# Altium project TX.PrjPCB
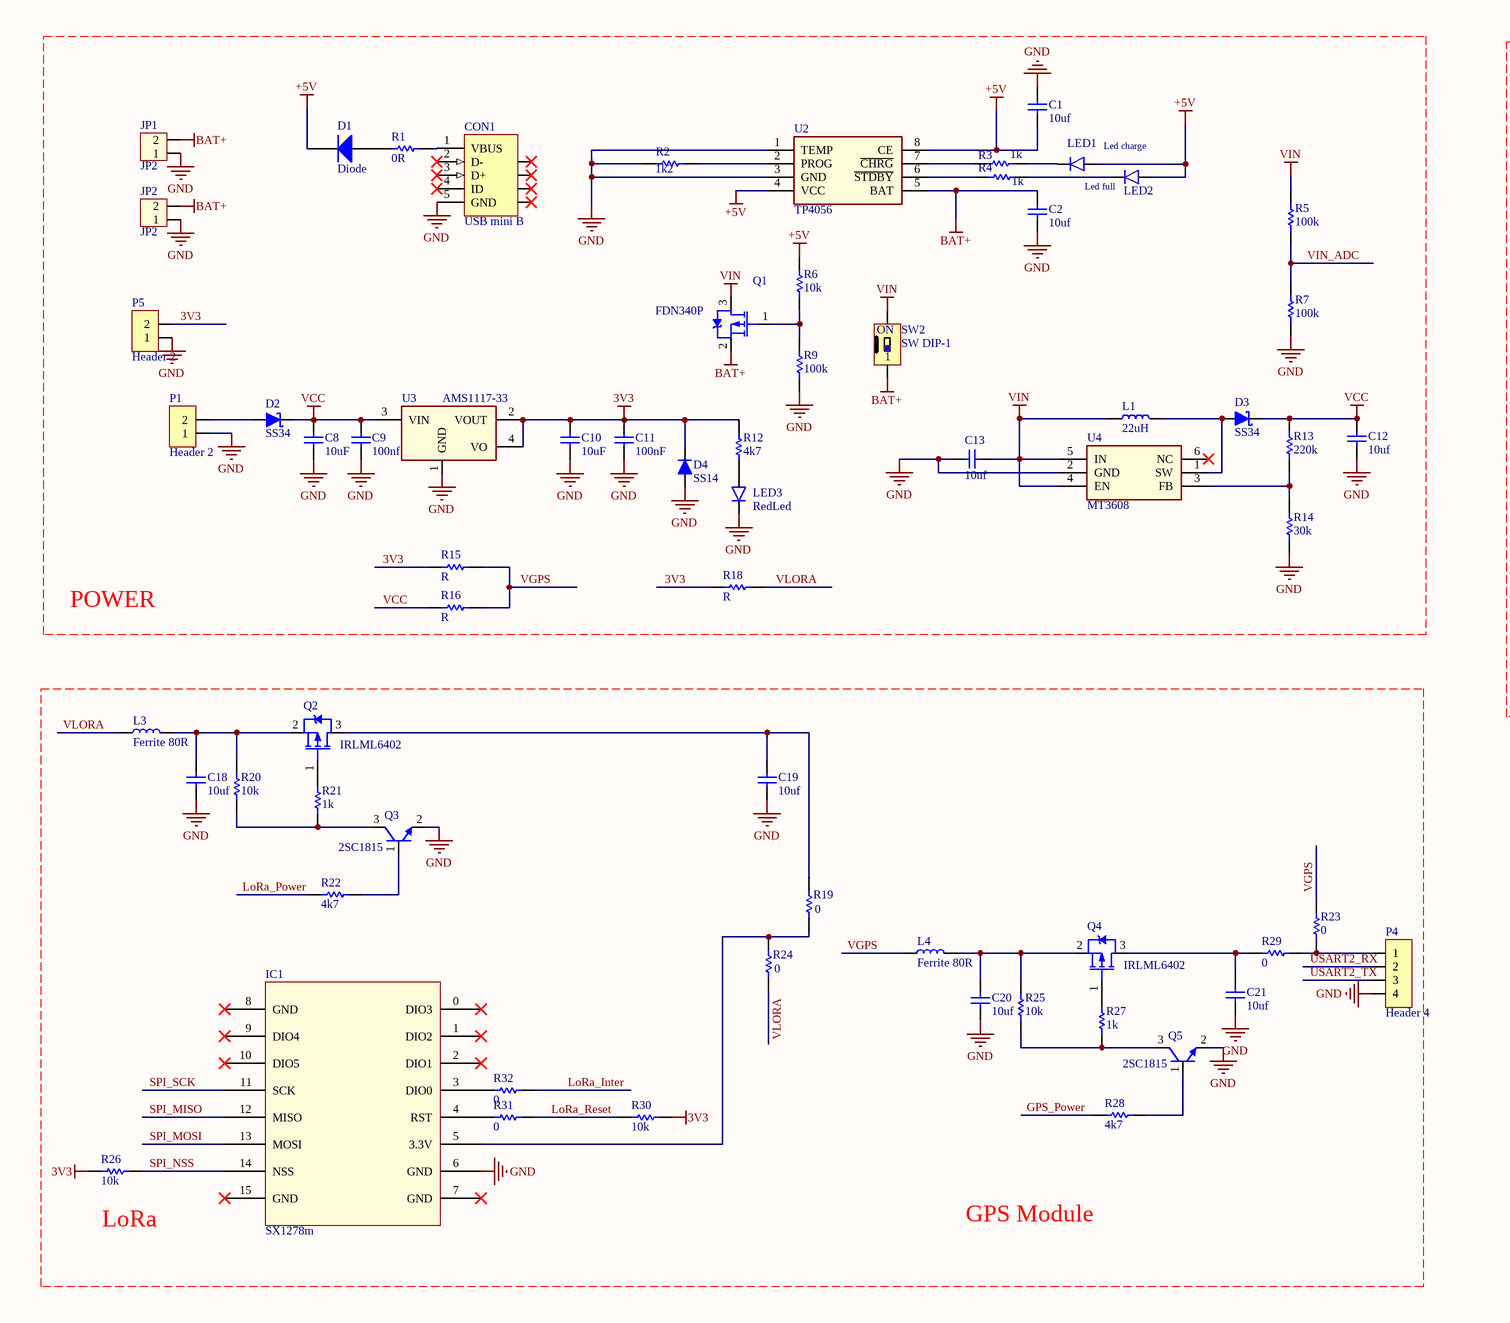
[diagram p0: Schematic_TX.schdoc, left]
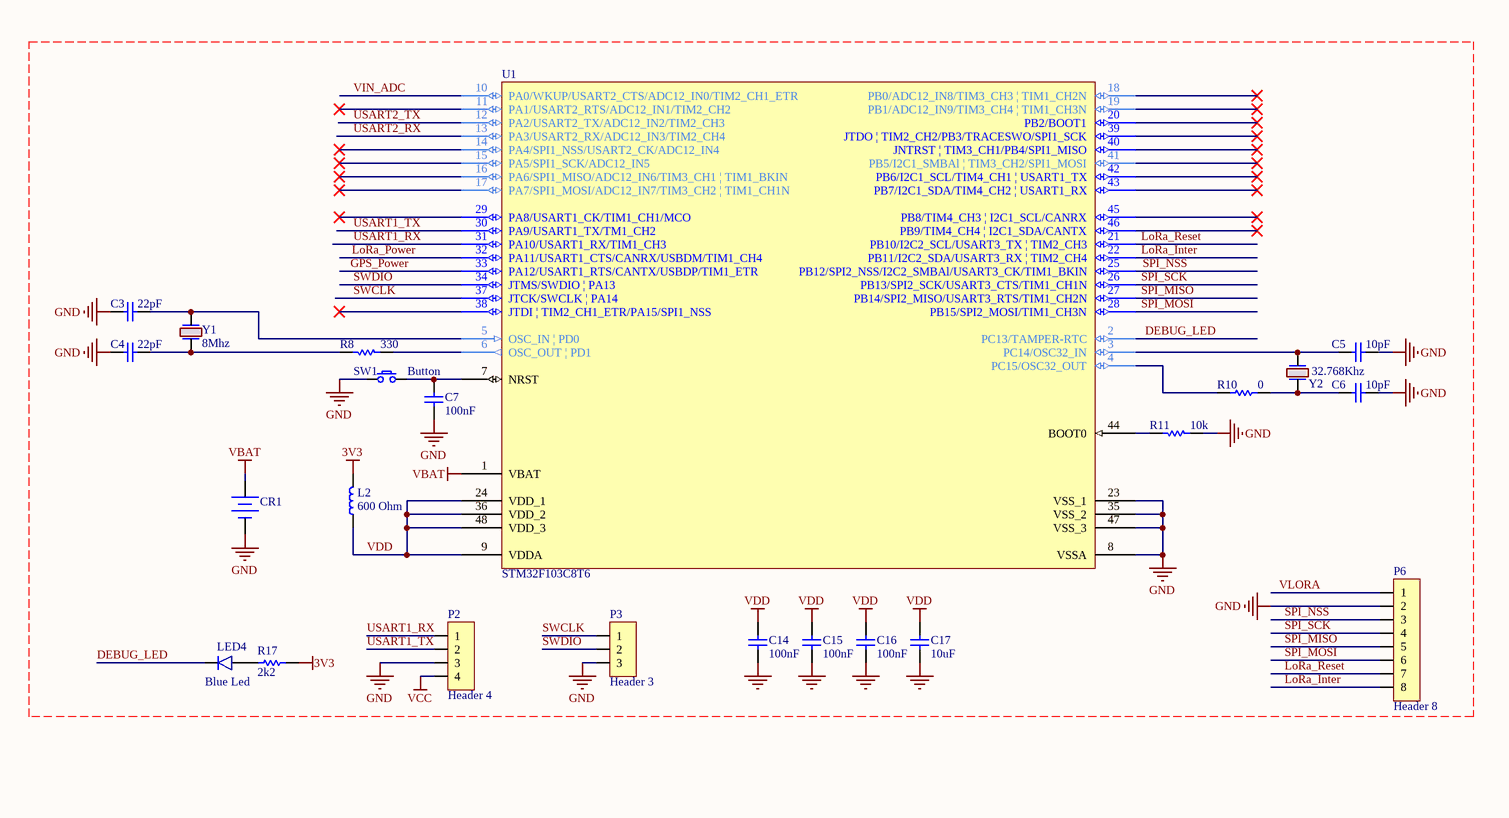
[diagram p1: Schematic_TX.schdoc, right]
1 sheet, 89 parts. Net scope: global (net labels, ports and power ports of the same name join across sheets).
Board file: PCB_TX.PcbDoc

## Sheet Schematic_TX.schdoc
size A1

### Parts
C1  10uf  [C 0805 (2012)]
C2  10uf  [C 0805 (2012)]
C3  22pF  [C 0805 (2012)]
C4  22pF  [C 0805 (2012)]
C5  10pF  [C 0805 (2012)]
C6  10pF  [C 0805 (2012)]
C7  100nF  [C 0805 (2012)]
C8  10uF  [C 0805 (2012)]
C9  100nf  [C 0805 (2012)]
C10  10uF  [C 0805 (2012)]
C11  100nF  [C 0805 (2012)]
C12  10uf  [C 0805 (2012)]
C13  10uf  [C 0805 (2012)]
C14  100nF  [C 0805 (2012)]
C15  100nF  [C 0805 (2012)]
C16  100nF  [C 0805 (2012)]
C17  10uF  [C 0805 (2012)]
C18  10uf  [C 0805 (2012)]
C19  10uf  [C 0805 (2012)]
C20  10uf  [C 0805 (2012)]
C21  10uf  [C 0805 (2012)]
CON1  USB mini B  [CON USB B Mini]
CR1  (no value)  [CON CR1220]
D1  Diode  [SMC]
D2  SS34  [DO-214AC (SMA)]
D3  SS34  [DO-214AC (SMA)]
D4  SS14  [DO-214AC (SMA)]
IC1  SX1278m  [SX1287m]
JP1  JP2  [CON Header 2]
JP2  JP2  [CON Header 2]
L1  22uH  [Inductor SMD 12x12x8]
L2  600 Ohm  [Inductor SMD 0805 (2012)]
L3  Ferrite 80R  [Inductor SMD 0805 (2012)]
L4  Ferrite 80R  [Inductor SMD 0805 (2012)]
LED1  Led  [Led SMD 0805]  (value not drawn)
LED2  Led  [Led SMD 0805]  (value not drawn)
LED3  RedLed  [Led SMD 0805]
LED4  Blue Led  [Led SMD 0805]
P1  Header 2  [Header 2]
P2  Header 4  [CON Header 4]
P3  Header 3  [Header 3]
P4  Header 4  [Header 4]
P5  Header 2  [Header 2]
P6  Header 8  [Header 8]
Q1  FDN340P  [SOT-23]
Q2  IRLML6402  [SOT-23]
Q3  2SC1815  [SOT-23]
Q4  IRLML6402  [SOT-23]
Q5  2SC1815  [SOT-23]
R1  0R  [R 0805 (2012)]
R2  1k2  [R 0805 (2012)]
R3  1k  [R 0805 (2012)]
R4  1k  [R 0805 (2012)]
R5  100k  [R 0805 (2012)]
R6  10k  [R 0805 (2012)]
R7  100k  [R 0805 (2012)]
R8  330  [R 0805 (2012)]
R9  100k  [R 0805 (2012)]
R10  0  [R 0805 (2012)]
R11  10k  [R 0805 (2012)]
R12  4k7  [R 0805 (2012)]
R13  220k  [R 0805 (2012)]
R14  30k  [R 0805 (2012)]
R15  R  [R 0805 (2012)]
R16  R  [R 0805 (2012)]
R17  2k2  [R 0805 (2012)]
R18  R  [R 0805 (2012)]
R19  0  [R 0805 (2012)]
R20  10k  [R 0805 (2012)]
R21  1k  [R 0805 (2012)]
R22  4k7  [R 0805 (2012)]
R23  0  [R 0805 (2012)]
R24  0  [R 0805 (2012)]
R25  10k  [R 0805 (2012)]
R26  10k  [R 0805 (2012)]
R27  1k  [R 0805 (2012)]
R28  4k7  [R 0805 (2012)]
R29  0  [R 0805 (2012)]
R30  10k  [R 0805 (2012)]
R31  0  [R 0805 (2012)]
R32  0  [R 0805 (2012)]
SW1  Button  [SW/2/SMD]
SW2  SW DIP-1  [SW/DIP1]
U1  STM32F103C8T6  [LQFP48_N]
U2  TP4056  [SOIC-8]
U3  AMS1117-33  [SOT-223]
U4  MT3608  [SOT-363-6]
Y1  8Mhz  [Crystal HC49US SMD]
Y2  32.768Khz  [Crystal DIP-2]

### Nets
3V3: C10.1 C11.1 D4.2(K) L2.2 P5.2 R12.1 R15.1 R17.2 R18.1 R26.1 R30.1 U3.2(VOUT) U3.4(VO)
+5V: C1.2 D1.2(K) LED1.1(A) LED2.1(A) R6.2 U2.4(VCC) U2.8(CE)
BAT+: C2.1 JP1.2 JP2.2 Q1.2(S) SW2.1 U2.5(BAT)
GND: C1.1 C2.2 C3.2 C4.2 C5.2 C6.2 C7.2 C8.2 C9.2 C10.2 C11.2 C12.2 C13.1 C14.2 C15.2 C16.2 C17.2 C18.2 C19.2 C20.2 C21.2 CON1.5(GND) CR1.2(GND) D4.1(A) IC1.6(GND) JP1.1 JP2.1 LED3.2(K) P1.1 P2.3 P3.3 P4.4 P5.1 P6.2 Q3.2(E) Q5.2(E) R7.1 R9.1 R11.1 R14.1 SW1.1 U1.8(VSSA) U1.23(VSS_1) U1.35(VSS_2) U1.47(VSS_3) U3.1(GND) U4.2(GND)
VBAT: CR1.1(VCC) U1.1(VBAT)
VCC: C8.1 C9.1 C12.1 D2.2(K) D3.2(K) P2.4 R13.2 R16.1 U3.3(VIN)
VDD: C14.1 C15.1 C16.1 C17.1 L2.1 U1.9(VDDA) U1.24(VDD_1) U1.36(VDD_2) U1.48(VDD_3)
VIN: C13.2 L1.1 Q1.3(D) R5.2 SW2.2 U4.4(EN) U4.5(IN)
DEBUG_LED: LED4.2(K) U1.2(PC13/TAMPER-RTC)
GPS_Power: R28.1 U1.33(PA12/USART1_RTS/CANTX/USBDP/TIM1_ETR)
LoRa_Inter: P6.8 R32.2 U1.22(PB11/I2C2_SDA/USART3_RX_|_TIM2_CH4)
LoRa_Power: R22.1 U1.32(PA11/USART1_CTS/CANRX/USBDM/TIM1_CH4)
LoRa_Reset: P6.7 R30.2 R31.2 U1.21(PB10/I2C2_SCL/USART3_TX_|_TIM2_CH3)
SPI_MISO: IC1.12(MISO) P6.5 U1.27(PB14/SPI2_MISO/USART3_RTS/TIM1_CH2N)
SPI_MOSI: IC1.13(MOSI) P6.6 U1.28(PB15/SPI2_MOSI/TIM1_CH3N)
SPI_NSS: IC1.14(NSS) P6.3 R26.2 U1.25(PB12/SPI2_NSS/I2C2_SMBAl/USART3_CK/TIM1_BKIN)
SPI_SCK: IC1.11(SCK) P6.4 U1.26(PB13/SPI2_SCK/USART3_CTS/TIM1_CH1N)
SWCLK: P3.1 U1.37(JTCK/SWCLK_|_PA14)
SWDIO: P3.2 U1.34(JTMS/SWDIO_|_PA13)
USART1_RX: P2.1 U1.31(PA10/USART1_RX/TIM1_CH3)
USART1_TX: P2.2 U1.30(PA9/USART1_TX/TM1_CH2)
USART2_RX: P4.2 U1.13(PA3/USART2_RX/ADC12_IN3/TIM2_CH4)
USART2_TX: P4.3 U1.12(PA2/USART2_TX/ADC12_IN2/TIM2_CH3)
VGPS: L4.1 R15.2 R16.2 R23.1
VIN_ADC: R5.1 R7.2 U1.10(PA0/WKUP/USART2_CTS/ADC12_IN0/TIM2_CH1_ETR)
VLORA: L3.1 P6.1 R18.2 R24.1
NetC3_1: C3.1 U1.5(OSC_IN_|_PD0) Y1.2
NetC4_1: C4.1 R8.2 Y1.1
NetC5_1: C5.1 U1.3(PC14/OSC32_IN) Y2.2
NetC6_1: C6.1 R10.2 Y2.1
NetC7_1: C7.1 SW1.2 U1.7(NRST)
NetC18_1: C18.1 L3.2 Q2.2(S) R20.2
NetC19_1: C19.1 Q2.3(D) R19.2
NetC20_1: C20.1 L4.2 Q4.2(S) R25.2
NetC21_1: C21.1 Q4.3(D) R29.1
NetCON1_1: CON1.1(VBUS) R1.2
NetD1_1: D1.1(A) R1.1
NetD2_1: D2.1(A) P1.2
NetD3_1: D3.1(A) L1.2 U4.1(SW)
NetIC1_3: IC1.3(DIO0) R32.1
NetIC1_4: IC1.4(RST) R31.1
NetIC1_5: IC1.5(3.3V) R19.1 R24.2
NetLED1_2: LED1.2(K) R3.2
NetLED2_2: LED2.2(K) R4.2
NetLED3_1: LED3.1(A) R12.2
NetLED4_1: LED4.1(A) R17.1
NetP4_1: P4.1 R23.2 R29.2
NetQ1_1: Q1.1(G) R6.1 R9.2
NetQ2_1: Q2.1(G) R21.2
NetQ3_1: Q3.1(B) R22.2
NetQ3_3: Q3.3(C) R20.1 R21.1
NetQ4_1: Q4.1(G) R27.2
NetQ5_1: Q5.1(B) R28.2
NetQ5_3: Q5.3(C) R25.1 R27.1
NetR2_1: R2.1 U2.1(TEMP) U2.3(GND)
NetR2_2: R2.2 U2.2(PROG)
NetR3_1: R3.1 U2.7(~{CHRG})
NetR4_1: R4.1 U2.6(~{STDBY})
NetR8_1: R8.1 U1.6(OSC_OUT_|_PD1)
NetR10_1: R10.1 U1.4(PC15/OSC32_OUT)
NetR11_2: R11.2 U1.44(BOOT0)
NetR13_1: R13.1 R14.2 U4.3(FB)

Not connected (* = marked no-connect by the designer): CON1 2(D-)* 3(D+)* 4(ID)* 6(SHLD)* 7(SHLD)* 8(SHLD)* 9(SHLD)*; IC1 0(DIO3)* 1(DIO2)* 2(DIO1)* 7(GND)* 8(GND)* 9(DIO4)* 10(DIO5)* 15(GND)*; U1 11(PA1/USART2_RTS/ADC12_IN1/TIM2_CH2)* 14(PA4/SPI1_NSS/USART2_CK/ADC12_IN4)* 15(PA5/SPI1_SCK/ADC12_IN5)* 16(PA6/SPI1_MISO/ADC12_IN6/TIM3_CH1_|_TIM1_BKIN)* 17(PA7/SPI1_MOSI/ADC12_IN7/TIM3_CH2_|_TIM1_CH1N)* 18(PB0/ADC12_IN8/TIM3_CH3_|_TIM1_CH2N)* 19(PB1/ADC12_IN9/TIM3_CH4_|_TIM1_CH3N)* 20(PB2/BOOT1)* 29(PA8/USART1_CK/TIM1_CH1/MCO)* 38(JTDI_|_TIM2_CH1_ETR/PA15/SPI1_NSS)* 39(JTDO_|_TIM2_CH2/PB3/TRACESWO/SPI1_SCK)* 40(JNTRST_|_TIM3_CH1/PB4/SPI1_MISO)* 41(PB5/I2C1_SMBAl_|_TIM3_CH2/SPI1_MOSI)* 42(PB6/I2C1_SCL/TIM4_CH1_|_USART1_TX)* 43(PB7/I2C1_SDA/TIM4_CH2_|_USART1_RX)* 45(PB8/TIM4_CH3_|_I2C1_SCL/CANRX)* 46(PB9/TIM4_CH4_|_I2C1_SDA/CANTX)*; U4 6(NC)*

### Notes on the sheet
- Led charge
- (near LED2) Led full
- POWER
- (near R26) LoRa
- GPS Module
- (in symbol SW DIP-1) ON

### Library data of the parts
C1-C21 = Capacitor NP: Capacitor non-pol
CON1 = CON USB mini B: USB mini type B, 5 pins
CR1 = Battery
D1 D4 = Diode: Default Diode; Published: 8-Jun-2000; LatestRevisionDate: 17-Jul-2002; LatestRevisionNote: Re-released for DXP Platform.; PackageVersion: Sep-1996; PackageReference: SMC; Publisher: Altium Limited; Code_JEDEC: DO-214-AB
  D1: PackageDescription: DO-214-AB/SMC; 2 C-Bend Leads; Body 7.9 x 5.9 mm, inc. leads (LxW)
D2 D3 = Diode Schottky: Schottky Diode; Published: 8-Jun-2000; LatestRevisionDate: 17-Jul-2002; LatestRevisionNote: Re-released for DXP Platform.; PackageReference: SMB; Publisher: Altium Limited; Code_JEDEC: DO-214-AA
IC1 = SX1278m: SX1278 - Module LoRa
JP1 JP2 = Con2: Connector 2; Value: Connector 2
L1 L2 = Inductor
L3 L4 = Inductor: Ferrite
LED1-LED4 = Led: Typical LED
P1 P5 = Header 2: Header, 2-Pin; LatestRevisionDate: 17-Jul-2002; LatestRevisionNote: Re-released for DXP Platform.; Publisher: Altium Limited
P2 P4 = Header 4: Header, 4-Pin
P3 = Header 3: Header, 3-Pin
P6 = Header 8: Header, 8-Pin; LatestRevisionDate: 17-Jul-2002; LatestRevisionNote: Re-released for DXP Platform.; Publisher: Altium Limited
Q1 Q2 Q4 = MOSFET P-Channel
Q3 Q5 = Transistor NPN: NPN Bipolar Transistor
R1-R32 = Resistor: Published: 8-Jun-2000; LatestRevisionDate: 17-Jul-2002; LatestRevisionNote: Re-released for DXP Platform.; PackageReference: AXIAL-0.3; Publisher: Altium Limited
SW1 = SW SPST: Tact switch 2 pin
U1 = STM32F103C8T6: STM32 ARM-based 32-bit MCU with 64 Kbytes Flash, 48-pin LQFP, Industrial Temperature; Published: 30-May-2008; DatasheetVersion: rev6, Mar-2008; PackageVersion: Mar-2008; PackageReference: LQFP48; Publisher: Altium Limited; PackageDescription: 48-Pin Low-Profile Quad Flat Pack, 7 x 7 mm Body, 0.5 mm Pitch (LQFP48); ComponentLink1Description: Manufacturer Link; ComponentLink1URL: www.st.com/stm32; ComponentLink2Description: Datasheet; ComponentLink2URL: http://www.st.com/stonline/products/literature/ds/13587.pdf
U2 = TP4056: 1A Standalone Linear Li-lon Battery Charger with Thermal  Regulation
U3 = AMS1117: 1A LDO Voltage Regulator, ADJ or fixed 1.5/1.8/2.5/2.85/3.3/5V
Y1 Y2 = Crystal